# EAGLE design mimot (EAGLE 5.10)
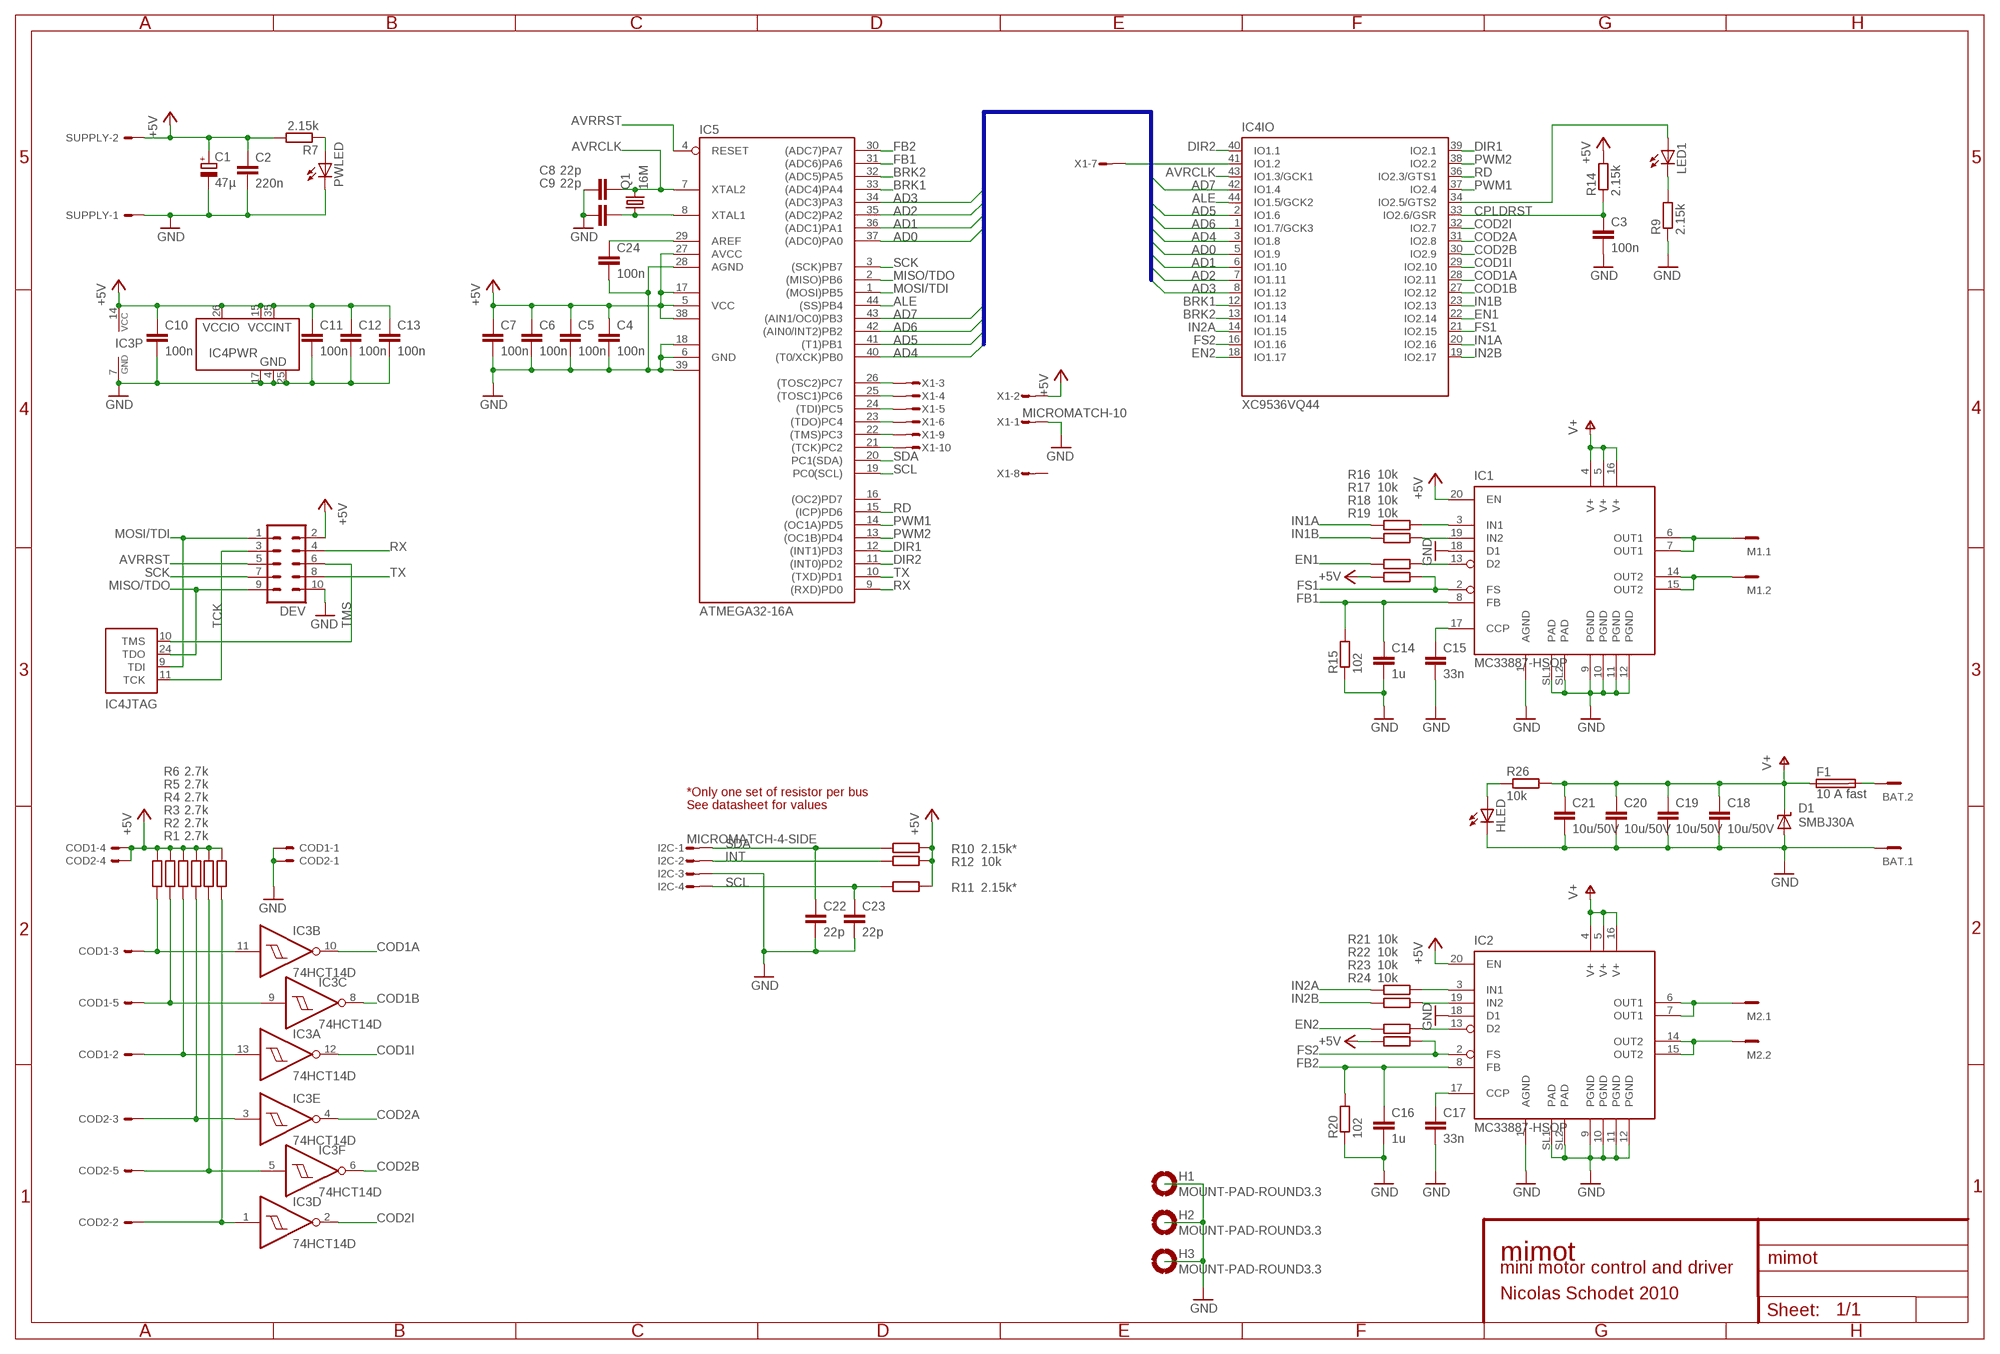
[diagram p0: schematic, sheet 1]

## Parts
BAT  MC2  [MC2]
C1  47µ  CPOL-EUC  [PANASONIC_C]
C2  220n  C-EUC0603  [C0603]
C3  100n  C-EUC0603  [C0603]
C4  100n  C-EUC0603  [C0603]
C5  100n  C-EUC0603  [C0603]
C6  100n  C-EUC0603  [C0603]
C7  100n  C-EUC0603  [C0603]
C8  22p  C-EUC0603  [C0603]
C9  22p  C-EUC0603  [C0603]
C10  100n  C-EUC0603  [C0603]
C11  100n  C-EUC0603  [C0603]
C12  100n  C-EUC0603  [C0603]
C13  100n  C-EUC0603  [C0603]
C14  1u  C-EUC0603  [C0603]
C15  33n  C-EUC0603  [C0603]
C16  1u  C-EUC0603  [C0603]
C17  33n  C-EUC0603  [C0603]
C18  10u/50V  C-EUC1210  [C1210]
C19  10u/50V  C-EUC1210  [C1210]
C20  10u/50V  C-EUC1210  [C1210]
C21  10u/50V  C-EUC1210  [C1210]
C22  22p  C-EUC0603  [C0603]
C23  22p  C-EUC0603  [C0603]
C24  100n  C-EUC0603  [C0603]
COD1  EC1X05  [EC1X05]
COD2  EC1X05  [EC1X05]
D1  SMBJ30A  SUPPRESSOR-SMBJ  [SMBJ]
DEV  ML10L  [ML10L]
F1  10 A fast  FUSE0448  [0448]
H1  MOUNT-PAD-ROUND3.3  [3,3-PAD]
H2  MOUNT-PAD-ROUND3.3  [3,3-PAD]
H3  MOUNT-PAD-ROUND3.3  [3,3-PAD]
HLED  LEDSMT1206  [1206]
I2C  MICROMATCH-4-SIDE  [MICROMATCH-4-SIDE]
IC1  MC33887-HSOP  [HSOP]
IC2  MC33887-HSOP  [HSOP]
IC3  74HCT14D  [SO14]
IC4  XC9536VQ44  [VQFP44]
IC5  ATMEGA32-16A  [TQFP44]
LED1  LEDSMT1206  [1206]
M1  MC2  [MC2]
M2  MC2  [MC2]
PWLED  LEDSMT1206  [1206]
Q1  16M  QUARTZ  [ABM3]
R1  2.7k  R-EU_R0603  [R0603]
R2  2.7k  R-EU_R0603  [R0603]
R3  2.7k  R-EU_R0603  [R0603]
R4  2.7k  R-EU_R0603  [R0603]
R5  2.7k  R-EU_R0603  [R0603]
R6  2.7k  R-EU_R0603  [R0603]
R7  2.15k  R-EU_R0603  [R0603]
R9  2.15k  R-EU_R0603  [R0603]
R10  2.15k*  R-EU_R0603  [R0603]
R11  2.15k*  R-EU_R0603  [R0603]
R12  10k  R-EU_R0603  [R0603]
R14  2.15k  R-EU_R0603  [R0603]
R15  102  R-EU_R0603  [R0603]
R16  10k  R-EU_R0603  [R0603]
R17  10k  R-EU_R0603  [R0603]
R18  10k  R-EU_R0603  [R0603]
R19  10k  R-EU_R0603  [R0603]
R20  102  R-EU_R0603  [R0603]
R21  10k  R-EU_R0603  [R0603]
R22  10k  R-EU_R0603  [R0603]
R23  10k  R-EU_R0603  [R0603]
R24  10k  R-EU_R0603  [R0603]
R26  10k  R-EU_R0603  [R0603]
SUPPLY  EC1X02  [EC1X02]
X1  MICROMATCH-10  [MICROMATCH-10]

## Nets
+5V [supply]: C1.+ C2.1 C4.1 C5.1 C6.1 C7.1 C10.1 C11.1 C12.1 C13.1 COD1.4 COD2.4 DEV.2 IC1.20(EN) IC2.20(EN) IC3.14(P:VCC) IC4.15(PWR:VCCINT) IC4.26(PWR:VCCIO) IC4.35(PWR:VCCINT) IC5.5(VCC) IC5.17(VCC1) IC5.27(AVCC) IC5.38(VCC2) R1.2 R2.2 R3.2 R4.2 R5.2 R6.2 R7.2 R10.2 R11.2 R12.2 R14.2 R19.1 R24.1 SUPPLY.2 X1.2
AD0: IC4.5(IO:IO1.9) IC5.37((ADC0)PA0)
AD1: IC4.6(IO:IO1.10) IC5.36((ADC1)PA1)
AD2: IC4.7(IO:IO1.11) IC5.35((ADC2)PA2)
AD3: IC4.8(IO:IO1.12) IC5.34((ADC3)PA3)
AD4: IC4.3(IO:IO1.8) IC5.40((T0/XCK)PB0)
AD5: IC4.2(IO:IO1.6) IC5.41((T1)PB1)
AD6: IC4.1(IO:IO1.7/GCK3) IC5.42((AIN0/INT2)PB2)
AD7: IC4.42(IO:IO1.4) IC5.43((AIN1/OC0)PB3)
ALE: IC4.44(IO:IO1.5/GCK2) IC5.44((SS)PB4)
AREF: C24.1 IC5.29(AREF)
AVRCLK: C8.2 IC4.43(IO:IO1.3/GCK1) IC5.7(XTAL2) Q1.2
AVRRST: DEV.5 IC5.4(RESET)
BRK1: IC4.12(IO:IO1.13) IC5.33((ADC4)PA4)
BRK2: IC4.13(IO:IO1.14) IC5.32((ADC5)PA5)
CCP1: C15.1 IC1.17(CCP)
CCP2: C17.1 IC2.17(CCP)
COD1A: IC3.10(B:O) IC4.28(IO:IO2.11)
COD1AP: COD1.3 IC3.11(B:I) R6.1
COD1B: IC3.8(C:O) IC4.27(IO:IO2.12)
COD1BP: COD1.5 IC3.9(C:I) R5.1
COD1I: IC3.12(A:O) IC4.29(IO:IO2.10)
COD1IP: COD1.2 IC3.13(A:I) R4.1
COD2A: IC3.4(E:O) IC4.31(IO:IO2.8)
COD2AP: COD2.3 IC3.3(E:I) R3.1
COD2B: IC3.6(F:O) IC4.30(IO:IO2.9)
COD2BP: COD2.5 IC3.5(F:I) R2.1
COD2I: IC3.2(D:O) IC4.32(IO:IO2.7)
COD2IP: COD2.2 IC3.1(D:I) R1.1
CPLDRST: C3.1 IC4.33(IO:IO2.6/GSR) R14.1
DIR1: IC4.39(IO:IO2.1) IC5.12((INT1)PD3)
DIR2: IC4.40(IO:IO1.1) IC5.11((INT0)PD2)
EN1: IC4.22(IO:IO2.14) R18.1
EN1M: IC1.13(D2) R18.2
EN2: IC4.18(IO:IO1.17) R23.1
EN2M: IC2.13(D2) R23.2
FB1: C14.1 IC1.8(FB) IC5.31((ADC6)PA6) R15.2
FB2: C16.1 IC2.8(FB) IC5.30((ADC7)PA7) R20.2
FS1: IC1.2(FS) IC4.21(IO:IO2.15) R19.2
FS2: IC2.2(FS) IC4.16(IO:IO1.16) R24.2
GND [supply]: BAT.1 C1.- C2.2 C3.2 C4.2 C5.2 C6.2 C7.2 C8.1 C9.1 C10.2 C11.2 C12.2 C13.2 C14.2 C15.2 C16.2 C17.2 C18.2 C19.2 C20.2 C21.2 C22.2 C23.2 C24.2 COD1.1 COD2.1 D1.A DEV.10 H1.B3,3(MOUNT) H2.B3,3(MOUNT) H3.B3,3(MOUNT) HLED.C I2C.3 IC1.1(AGND) IC1.9(PGND) IC1.10(PGND) IC1.11(PGND) IC1.12(PGND) IC1.18(D1) IC1.SL1(PAD) IC1.SL2(PAD) IC2.1(AGND) IC2.9(PGND) IC2.10(PGND) IC2.11(PGND) IC2.12(PGND) IC2.18(D1) IC2.SL1(PAD) IC2.SL2(PAD) IC3.7(P:GND) IC4.4(PWR:GND) IC4.17(PWR:GND) IC4.25(PWR:GND) IC5.6(GND) IC5.18(GND1) IC5.28(AGND) IC5.39(GND2) PWLED.C R9.1 R15.1 R20.1 SUPPLY.1 X1.1
IN1A: IC4.20(IO:IO2.16) R16.1
IN1AM: IC1.3(IN1) R16.2
IN1B: IC4.23(IO:IO2.13) R17.1
IN1BM: IC1.19(IN2) R17.2
IN2A: IC4.14(IO:IO1.15) R21.1
IN2AM: IC2.3(IN1) R21.2
IN2B: IC4.19(IO:IO2.17) R22.1
IN2BM: IC2.19(IN2) R22.2
INT: I2C.2 R12.1
MISO/TDO: DEV.9 IC4.24(JTAG:TDO) IC5.2((MISO)PB6)
MOSI/TDI: DEV.1 IC4.9(JTAG:TDI) IC5.1((MOSI)PB5)
NHLED: HLED.A R26.1
NLED1: LED1.C R9.2
NLED1X: IC4.34(IO:IO2.5/GTS2) LED1.A
NPWLED: PWLED.A R7.1
NV+: BAT.2 F1.P$2
OUT1A: IC1.6(OUT1) IC1.7(OUT1) M1.1
OUT1B: IC1.14(OUT2) IC1.15(OUT2) M1.2
OUT2A: IC2.6(OUT1) IC2.7(OUT1) M2.1
OUT2B: IC2.14(OUT2) IC2.15(OUT2) M2.2
PC2: IC5.21((TCK)PC2) X1.10
PC3: IC5.22((TMS)PC3) X1.9
PC4: IC5.23((TDO)PC4) X1.6
PC5: IC5.24((TDI)PC5) X1.5
PC6: IC5.25((TOSC1)PC6) X1.4
PC7: IC5.26((TOSC2)PC7) X1.3
PCX: IC4.41(IO:IO1.2) X1.7
PWM1: IC4.37(IO:IO2.4) IC5.14((OC1A)PD5)
PWM2: IC4.38(IO:IO2.2) IC5.13((OC1B)PD4)
RD: IC4.36(IO:IO2.3/GTS1) IC5.15((ICP)PD6)
RX: DEV.4 IC5.9((RXD)PD0)
SCK: DEV.7 IC5.3((SCK)PB7)
SCL: C23.1 I2C.4 IC5.19(PC0(SCL)) R11.1
SDA: C22.1 I2C.1 IC5.20(PC1(SDA)) R10.1
TCK: DEV.3 IC4.11(JTAG:TCK)
TMS: DEV.6 IC4.10(JTAG:TMS)
TX: DEV.8 IC5.10((TXD)PD1)
V+: C18.1 C19.1 C20.1 C21.1 D1.C F1.P$1 IC1.4(V+) IC1.5(V+) IC1.16(V+) IC2.4(V+) IC2.5(V+) IC2.16(V+) R26.2
XTAL1: C9.2 IC5.8(XTAL1) Q1.1
Unconnected: IC5.16((OC2)PD7) X1.8

## Buses
AD[0..7]

## Notes on the sheet
- *Only one set of resistor per bus
- See datasheet for values
- mimot
- mini motor control and driver
- Nicolas Schodet 2010

## Library data of the parts
BAT M1 M2 = con-phoenix-381_l:MC2: Mini-Combicon 3.81mm horizontal 2-polig MC 1,5/2-G-3,81 Artikel-Nr. 1803277
C1 = rcl:CPOL-EU: POLARIZED CAPACITOR, European symbol
C2-C24 = rcl:C-EU: CAPACITOR, European symbol
COD1 COD2 = apbteam_con-amp-he14:E?1X05: Male header simple row, 5 positions
D1 = diode:SUPPRESSOR-: Suppressor diode
DEV = con-harting-ml:ML10: HARTING
F1 = apbteam_fuse:FUSE: FUSE
H1-H3 = holes:MOUNT-PAD-ROUND: MOUNTING PAD, round
HLED LED1 PWLED = led:LED: LED OSRAM: - CHIPLED LG R971, LG N971, LY N971, LG Q971, LY Q971, LO R971, LY R971 LH N974, LH R974 LS Q976, LO Q976, LY Q976 LO Q996 - Hyper CHIPLED LW Q18S LB Q993, LB Q99A, LB R99A - SideLED LS A670, LO A670, LY A670, LG A670, LP A670 LB A673, LV A673, LT A673, LW A673 LH A674 LY A675 LS A676, LA A676, LO A676, LY A676, LW A676 LS A679, LY A679, LG A679 - Hyper Micro SIDELED® LS Y876, LA Y876, LO Y876, LY Y876 LT Y87S - SmartLED LW L88C, LW L88S LB L89C, LB L89S, LG L890 LS L89K, LO L89K, LY L89K LS L896, LA L896, LO L896, LY L896 - TOPLED LS T670, LO T670, LY T670, LG T670, LP T670 LSG T670, LSP T670, LSY T670, LOP T670, LYG T670 LG T671, LOG T671, LSG T671 LB T673, LV T673, LT T673, LW T673 LH T674 LS T676, LA T676, LO T676, LY T676, LB T676, LH T676, LSB T676, LW T676 LB T67C, LV T67C, LT T67C, LS T67K, LO T67K, LY T67K, LW E67C LS E67B, LA E67B, LO E67B, LY E67B, LB E67C, LV E67C, LT E67C LW T67C LS T679, LY T679, LG T679 LS T770, LO T770, LY T770, LG T770, LP T770 LB T773, LV T773, LT T773, LW T773 LH T774 LS E675, LA E675, LY E675, LS T675 LS T776, LA T776, LO T776, LY T776, LB T776 LHGB T686 LT T68C, LB T68C - Hyper Mini TOPLED® LB M676 - Mini TOPLED Santana® LG M470 LS M47K, LO M47K, LY M47K Source: http://www.osram.convergy.de - LUMILED® LXK2-PW12-R00, LXK2-PW12-S00, LXK2-PW14-U00, LXK2-PW14-V00 LXK2-PM12-R00, LXK2-PM12-S00, LXK2-PM14-U00 LXK2-PE12-Q00, LXK2-PE12-R00, LXK2-PE12-S00, LXK2-PE14-T00, LXK2-PE14-U00 LXK2-PB12-K00, LXK2-PB12-L00, LXK2-PB12-M00, LXK2-PB14-N00, LXK2-PB14-P00, LXK2-PB14-Q00 LXK2-PR12-L00, LXK2-PR12-M00, LXK2-PR14-Q00, LXK2-PR14-R00 LXK2-PD12-Q00, LXK2-PD12-R00, LXK2-PD12-S00 LXK2-PH12-R00, LXK2-PH12-S00 LXK2-PL12-P00, LXK2-PL12-Q00, LXK2-PL12-R00 Source: www.luxeon.com
I2C = apbteam_con-amp-micromatch:MICROMATCH-4: MicroMaTch 4
IC1 IC2 = apbteam_mc33887:MC33887-HSOP: 5.0 A H-Bridge with Load Current Feedback
IC3 = 74xx-eu:74*14: Hex schmitt trigger INVERTER
IC4 = apbteam_xilinx-cpld:XC9536*?44: XC9536 In-System Programmable CPLD 36 macrocells
IC5 = avr:ATMEGA32: MICROCONTROLLER 32 Kbytes FLASH 2 Kbytes SRAM 1 Kbytes EEPROM USART 8-channel 10 bit ADC
Q1 = ni-crystal:QUARTZ
R1-R7 R9-R12 R14-R24 R26 = rcl:R-EU_: RESISTOR, European symbol
SUPPLY = apbteam_con-amp-he14:E?1X02: Male header simple row, 2 positions
X1 = apbteam_con-amp-micromatch:MICROMATCH-10: MicroMaTch 10

## Net classes
1 supply: width 0.254 mm

## Board
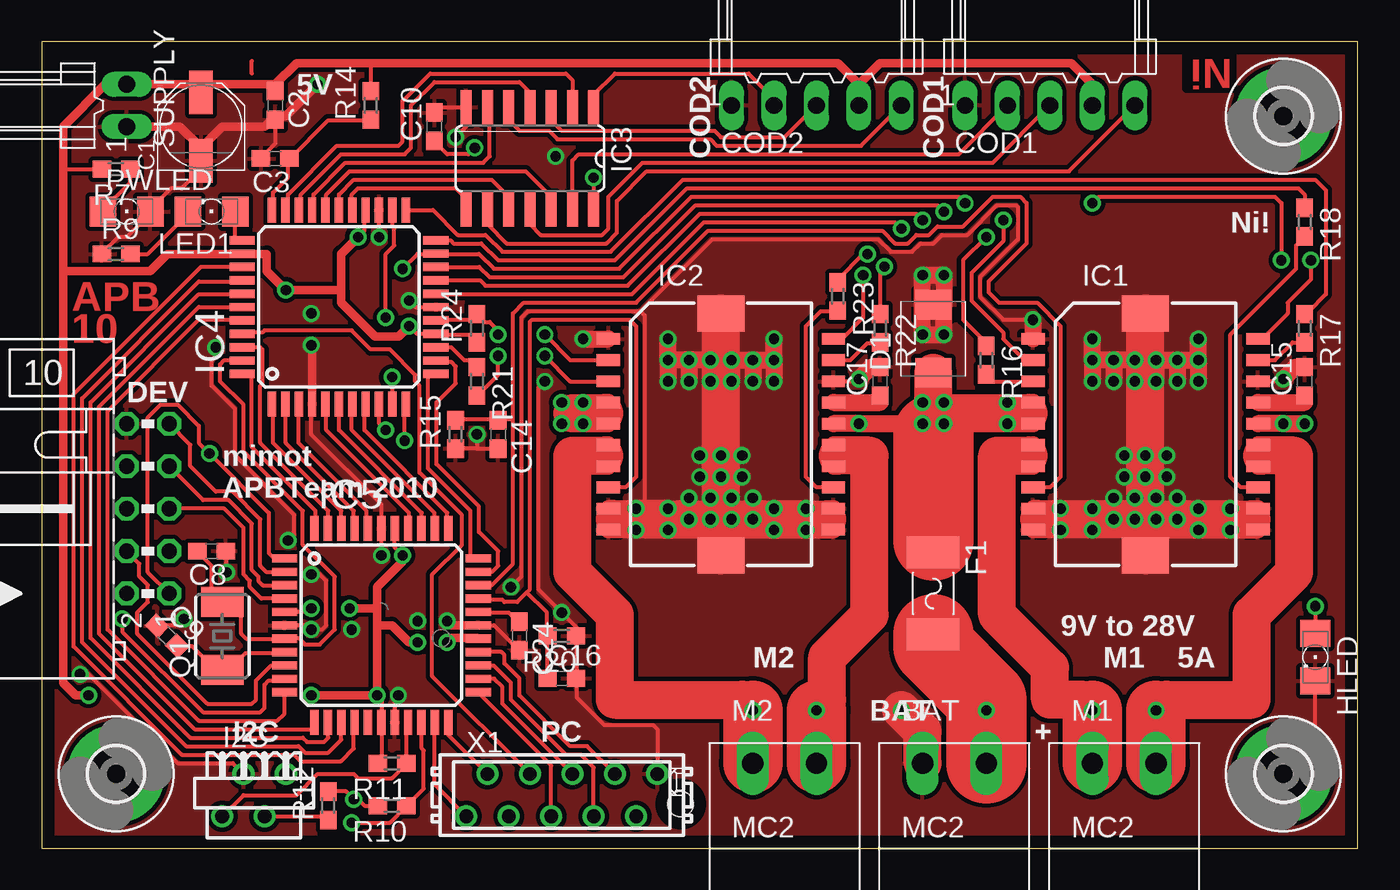
[diagram p1: board, top side]
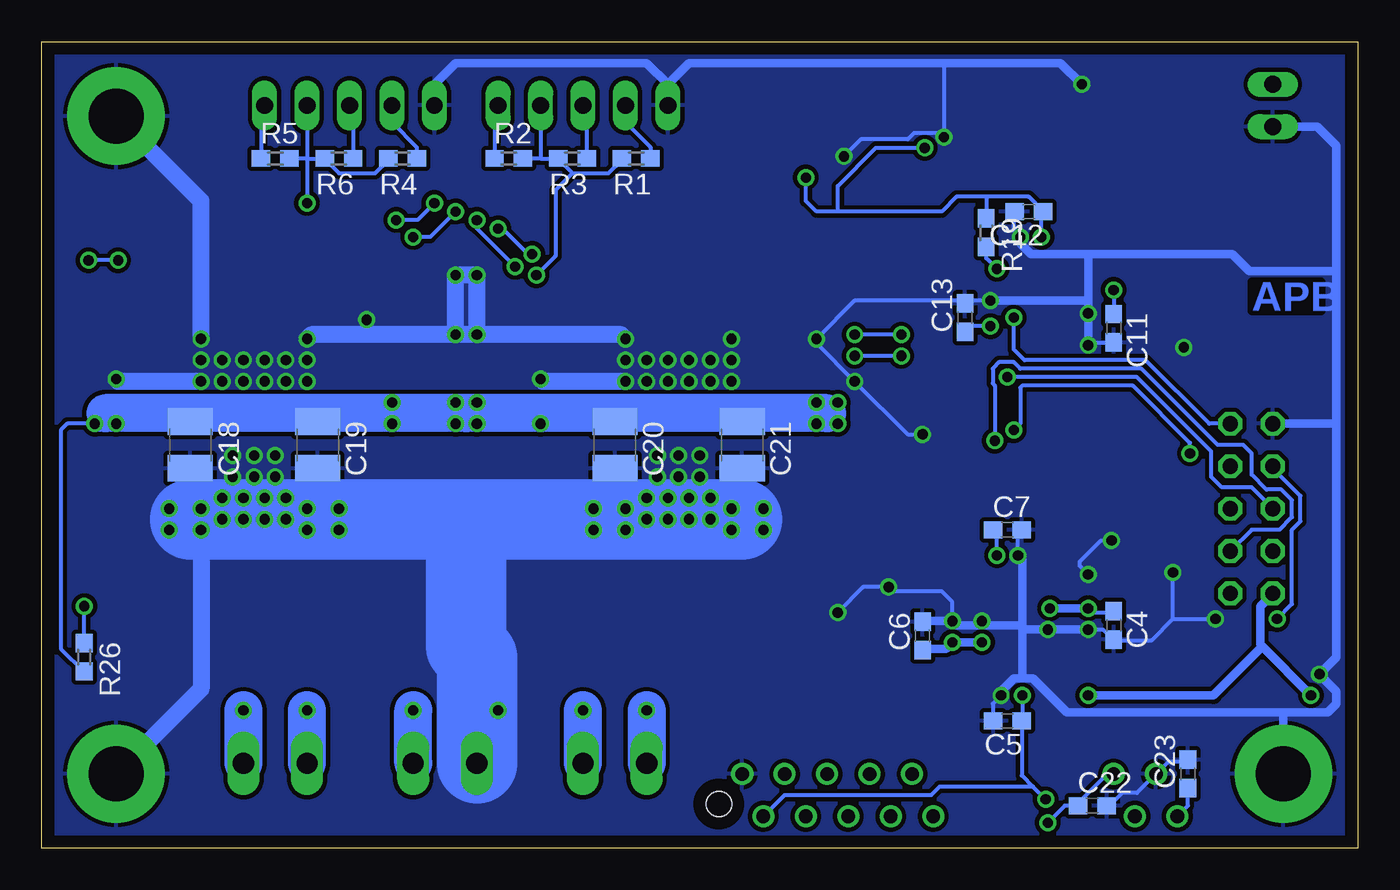
[diagram p2: board, bottom side, seen from below]

Size 78.74 x 48.26 mm. Coordinates in mm from the lower left corner, seen from the top.
Outline: 0,0 78.74,0 78.74,48.26 0,48.26 0,0
Copper layers (1*16): Top 0.035mm / dielectric 1.5mm / Bottom 0.035mm
Design rules "olimex *": minimum track width 10mil, minimum drill 24mil, track to track 10mil, track to pad 10mil, pad to pad 10mil, via to via 10mil, smd to smd 10mil, copper to edge 30mil, drill to drill 10mil, minimum pad ring 10mil, minimum via ring 8mil, stop-mask expansion 0mil, vias tented up to drill 100mil, thermal gap 10mil

### Footprints (pad centres in the part's own frame; a part is rotated, then mirrored left to right if it is on the bottom)
MC2 = drill 1.27 long: 1 -1.905,0; 2 1.905,0
PANASONIC_C = smd 2.6 x 1.4: + 2.05,0; - -2.05,0
C0603 = smd 1.1 x 1: 1 -0.85,0; 2 0.85,0
C1210 = smd 1.6 x 2.7: 1 -1.4,0; 2 1.4,0
EC1X05 = drill 1 long: 1 -5.08,0; 2 -2.54,0; 3 0,0; 4 2.54,0; 5 5.08,0
SMBJ = smd 1.78 x 2.16: A 2.04,0; C -2.03,0
ML10L = drill 0.914 octagon: 1 -5.08,-1.27; 2 -5.08,1.27; 3 -2.54,-1.27; 4 -2.54,1.27; 5 0,-1.27; 6 0,1.27; 7 2.54,-1.27; 8 2.54,1.27; 9 5.08,-1.27; 10 5.08,1.27
0448 = smd 1.9 x 3.15: P$1 -2.45,0; P$2 2.45,0
3,3-PAD = drill 3.3 pad 5.842 round: B3,3 0,0
1206 = smd 1.6 x 1.803: A -1.422,0; C 1.422,0
MICROMATCH-4-SIDE = drill 0.813 round: 1 1.905,1.27; 2 0.635,-1.27; 3 -0.635,1.27; 4 -1.905,-1.27
HSOP = smd 0.7 x 1.4: 1 -5.715,-6.731; 2 -4.445,-6.731; 3 -3.175,-6.731; 4 -1.905,-6.731; 5 -0.635,-6.731; 6 0.635,-6.731; 7 1.905,-6.731; 8 3.175,-6.731; 9 4.445,-6.731; 10 5.715,-6.731; 11 5.715,6.731; 12 4.445,6.731; 13 3.175,6.731; 14 1.905,6.731; 15 0.635,6.731; 16 -0.635,6.731; 17 -1.905,6.731; 18 -3.175,6.731; 19 -4.445,6.731; 20 -5.715,6.731 | smd 2.15 x 2.8: SL1 -7.239,0; SL2 7.239,0
SO14 = smd 0.66 x 2.032: 1 -3.81,-3.073; 2 -2.54,-3.073; 3 -1.27,-3.073; 4 0,-3.073; 5 1.27,-3.073; 6 2.54,-3.073; 7 3.81,-3.073; 8 3.81,3.073; 9 2.54,3.073; 10 1.27,3.073; 11 0,3.073; 12 -1.27,3.073; 13 -2.54,3.073; 14 -3.81,3.073
VQFP44 = smd 1.5 x 0.5: 1 -5.8,4; 2 -5.8,3.2; 3 -5.8,2.4; 4 -5.8,1.6; 5 -5.8,0.8; 6 -5.8,0; 7 -5.8,-0.8; 8 -5.8,-1.6; 9 -5.8,-2.4; 10 -5.8,-3.2; 11 -5.8,-4; 23 5.8,-4; 24 5.8,-3.2; 25 5.8,-2.4; 26 5.8,-1.6; 27 5.8,-0.8; 28 5.8,0; 29 5.8,0.8; 30 5.8,1.6; 31 5.8,2.4; 32 5.8,3.2; 33 5.8,4 | smd 0.5 x 1.5: 12 -4,-5.8; 13 -3.2,-5.8; 14 -2.4,-5.8; 15 -1.6,-5.8; 16 -0.8,-5.8; 17 0,-5.8; 18 0.8,-5.8; 19 1.6,-5.8; 20 2.4,-5.8; 21 3.2,-5.8; 22 4,-5.8; 34 4,5.8; 35 3.2,5.8; 36 2.4,5.8; 37 1.6,5.8; 38 0.8,5.8; 39 0,5.8; 40 -0.8,5.8; 41 -1.6,5.8; 42 -2.4,5.8; 43 -3.2,5.8; 44 -4,5.8
TQFP44 = smd 1.5 x 0.5: 1 -5.8,4; 2 -5.8,3.2; 3 -5.8,2.4; 4 -5.8,1.6; 5 -5.8,0.8; 6 -5.8,0; 7 -5.8,-0.8; 8 -5.8,-1.6; 9 -5.8,-2.4; 10 -5.8,-3.2; 11 -5.8,-4; 23 5.8,-4; 24 5.8,-3.2; 25 5.8,-2.4; 26 5.8,-1.6; 27 5.8,-0.8; 28 5.8,0; 29 5.8,0.8; 30 5.8,1.6; 31 5.8,2.4; 32 5.8,3.2; 33 5.8,4 | smd 0.5 x 1.5: 12 -4,-5.8; 13 -3.2,-5.8; 14 -2.4,-5.8; 15 -1.6,-5.8; 16 -0.8,-5.8; 17 0,-5.8; 18 0.8,-5.8; 19 1.6,-5.8; 20 2.4,-5.8; 21 3.2,-5.8; 22 4,-5.8; 34 4,5.8; 35 3.2,5.8; 36 2.4,5.8; 37 1.6,5.8; 38 0.8,5.8; 39 0,5.8; 40 -0.8,5.8; 41 -1.6,5.8; 42 -2.4,5.8; 43 -3.2,5.8; 44 -4,5.8
ABM3 = smd 1.778 x 2.54: 1 -2.032,0; 2 2.032,0
R0603 = smd 1.1 x 1: 1 -0.85,0; 2 0.85,0
EC1X02 = drill 1 long: 1 -1.27,0; 2 1.27,0
MICROMATCH-10 = drill 0.813 round: 1 5.715,1.27; 2 4.445,-1.27; 3 3.175,1.27; 4 1.905,-1.27; 5 0.635,1.27; 6 -0.635,-1.27; 7 -1.905,1.27; 8 -3.175,-1.27; 9 -4.445,1.27; 10 -5.715,-1.27 | hole 1.5: 7.11,-0.53

### Placement (x,y rotation side)
BAT  54.61,5.08 0 top
C1  9.53,43.18 90 top
C2  13.97,44.45 270 top
C3  13.97,41.27 180 top
C4  14.61,13.34 270 bottom
C5  20.95,7.62 180 bottom
C6  26.04,12.7 90 bottom
C7  20.95,19.05 0 bottom
C8  10.16,17.78 180 top
C9  7.49,12.7 315 top
C10  23.5,43.18 90 top
C11  14.61,31.11 270 bottom
C12  19.68,38.1 180 bottom
C13  23.5,31.75 90 bottom
C14  27.3,24.77 270 top
C15  75.56,27.94 90 top
C16  31.11,10.16 0 top
C17  50.16,27.94 90 top
C18  69.85,24.13 270 bottom
C19  62.23,24.13 270 bottom
C20  44.45,24.13 270 bottom
C21  36.83,24.13 270 bottom
C22  15.88,2.54 0 bottom
C23  10.16,4.45 90 bottom
C24  28.57,12.7 270 top
COD1  60.33,44.45 0 top
COD2  46.35,44.45 0 top
D1  53.34,30.48 90 top
DEV  6.35,20.32 90 top
F1  53.34,15.24 270 top
H1  4.45,4.45 0 top
H2  74.3,4.45 0 top
H3  74.3,43.81 0 top
HLED  76.2,11.43 270 top
I2C  12.7,3.17 0 top
IC1  66.04,24.77 270 top
IC2  40.64,24.77 270 top
IC3  29.21,41.27 180 top
IC4  17.78,32.38 90 top
IC5  20.32,13.34 0 top
LED1  10.16,38.1 180 top
M1  64.77,5.08 0 top
M2  44.45,5.08 0 top
PWLED  5.08,38.1 0 top
Q1  10.79,12.7 90 top
R1  43.18,41.27 180 bottom
R2  50.8,41.27 0 bottom
R3  46.99,41.27 180 bottom
R4  57.15,41.27 180 bottom
R5  64.77,41.27 0 bottom
R6  60.96,41.27 180 bottom
R7  4.45,40.64 180 top
R9  4.45,35.56 0 top
R10  20.95,2.54 180 top
R11  20.95,5.08 180 top
R12  17.14,2.54 90 top
R14  19.68,44.45 90 top
R15  24.77,24.77 90 top
R16  56.52,29.21 270 top
R17  75.56,31.11 270 top
R18  75.56,37.47 270 top
R19  22.23,36.83 270 bottom
R20  31.11,12.7 180 top
R21  26.04,27.94 270 top
R22  50.16,31.11 270 top
R23  47.62,33.02 270 top
R24  26.04,31.11 90 top
R26  76.2,11.43 270 bottom
SUPPLY  5.08,44.45 90 top
X1  31.11,3.17 0 top

### Tracks (layer width: path | path; a pad name or v marks a point on that pad's centre or on a via)
+5V  (via drill 0.61)
  Top 0.254: IC5.5 15.91,14.13 v16.13,14.35 | v33.02,40.13 IC3.14 | C10.1 23.5,42.29 24.26,41.53 25.53,41.53 v25.91,41.91 | IC5.38 21.12,18 v21.59,17.53 | IC4.26 19.3,38.1 19.3,36.96 v18.92,36.58 | v20.07,9.14 20.32,8.89 IC5.17 20.32,5.33 20.07,5.08 R11.2 | R10.2 19.3,2.54 18.92,2.92 v18.67,2.92 18.2,3.39 R12.2 | 1.27,40.64 R7.2 | v21.97,31.24 22.43,30.79 IC4.15 23.55,30.79 23.5,30.73 25.65,30.73 26.04,30.35 R24.1 | IC1.20 73.03,30.48 74.55,32 74.55,32.64 75.95,34.04 v75.95,35.18 | v74.17,35.18 74.17,38.61 73.79,38.99 63.25,38.99 v62.87,38.61 | IC2.20 47.88,30.48 49.15,31.75 v49.15,34.29 | 19.68,46.99 R14.2
  Top 0.508: 9.53,45.72 SUPPLY.2 3.81,45.72 1.27,43.18 1.27,40.64 1.27,34.54 | 9.53,45.72 C1.+ | 9.53,45.72 13.97,45.72 | 13.97,45.72 C2.1 | 13.97,45.72 15.24,46.99 19.68,46.99 47.62,46.99 48.9,45.72 | 48.9,45.72 COD2.4 | 48.9,45.72 50.16,46.99 61.59,46.99 62.87,45.72 COD1.4 | 1.27,34.54 1.27,9.91 2.03,9.14 v2.79,9.14 | 20.07,13.34 v20.07,9.14 v16.13,9.14 | 20.07,13.34 20.07,14.35 | 20.07,14.35 v18.41,14.35 | v21.59,17.53 21.59,17.14 20.07,15.62 20.07,14.35 | 20.07,13.34 20.95,13.34 21.97,12.32 v22.48,12.32 | IC5.27 26.07,12.54 26.04,12.57 24.51,12.57 v24.26,12.32 | 1.27,34.54 6.48,34.54 7.49,35.56 11.81,35.56 | v18.92,36.58 17.93,35.59 17.91,35.59 17.91,33.4 | v21.97,31.24 21.34,30.61 19.94,30.61 17.91,32.64 17.91,33.4 | IC4.35 11.84,35.59 11.81,35.56 | 11.81,35.56 13.46,35.56 13.46,34.54 v14.61,33.4 17.91,33.4
  Bottom 0.254: C4.1 14.73,14.1 15.88,14.1 v16.13,14.35 | C7.1 21.84,19.05 21.59,18.8 v21.59,17.53 | 62.87,41.27 R6.2 61.81,41.24 60.96,40.39 58.8,40.39 58,41.19 R4.2 | 62.87,41.27 R5.2 | COD1.4 62.87,41.27 | 48.9,41.27 R3.2 47.84,41.24 46.99,40.39 | 48.9,41.27 R2.2 | COD2.4 48.9,41.27 | R1.2 44.03,41.19 44.83,40.39 46.99,40.39 | v18.92,36.58 18.92,37.85 18.8,37.97 18.84,38.01 C12.1 18.84,38.14 19.68,38.99 22.23,38.99 | v20.07,9.14 20.07,7.75 20.11,7.71 C5.1 20.11,4.36 19.43,3.68 | 19.43,3.68 v18.67,2.92 | C13.1 23.5,31.24 v21.97,31.24 | v14.61,33.4 C11.1 | v33.02,40.13 33.02,38.73 32.38,38.1 31.11,38.1 | 31.11,38.1 24.89,38.1 24,38.99 22.23,38.99 | v74.17,35.18 v75.95,35.18 | 62.87,41.27 v62.87,38.61 | 22.23,38.99 R19.1 | 31.11,38.1 31.11,39.62 28.83,41.91 v25.91,41.91 | v49.15,34.29 48.01,35.43 48.01,39.37 46.99,40.39 | 19.43,3.68 25.02,3.68 25.53,3.17 34.29,3.17 X1.2
  Bottom 0.508: v18.41,14.35 v16.13,14.35 | v2.79,9.14 5.71,12.06 | 5.71,12.06 5.84,12.19 5.84,14.48 DEV.2 | 5.71,12.06 8.64,9.14 v16.13,9.14 | C6.1 26.04,11.94 24.64,11.94 v24.26,12.32 v22.48,12.32
AD0
  Top 0.254: IC5.37 21.97,19.18 21.97,20.07 17.02,25.02 17.02,26.42 16.98,26.45 IC4.5
AD1
  Top 0.254: IC5.36 22.72,19.16 22.73,19.18 22.73,20.07 17.78,25.02 IC4.6
AD2
  Top 0.254: IC5.35 23.52,19.28 23.5,19.3 23.5,20.07 18.54,25.02 18.54,26.54 18.58,26.5 IC4.7
AD3
  Top 0.254: IC5.34 24.32,19.24 24.26,19.3 24.26,20.07 19.3,25.02 19.3,26.42 19.38,26.49 IC4.8
AD4
  Top 0.254: IC5.40 19.43,19.3 19.43,20.19 15.37,24.26 15.37,26.42 15.38,26.43 IC4.3
AD5
  Top 0.254: IC5.41 18.72,19.25 18.67,19.3 18.67,20.19 14.61,24.26 14.61,26.67 14.58,26.64 IC4.2
AD6
  Top 0.254: IC5.42 17.92,19.16 | 17.92,19.16 17.91,19.18 | 17.92,19.16 17.92,20.18 13.84,24.26 13.84,26.42 13.78,26.48 IC4.1
AD7
  Top 0.254: IC5.43 17.12,19.15 17.14,19.18 17.14,20.19 13.08,24.26 13.08,27.69 13.21,27.81 13.21,29.84 13.08,29.97 12.06,29.97 12.05,29.98 IC4.42
ALE
  Top 0.254: IC5.44 16.34,19.14 16.38,19.18 16.38,20.19 12.57,24 12.57,28.19 12.38,28.39 IC4.44
AREF
  Top 0.254: IC5.29 26.16,14.1 27.94,14.1 28.49,13.55 C24.1
AVRCLK
  Top 0.254: IC4.43 11.96,29.18 11.94,29.21 10.92,29.21 10.67,28.96 10.67,27.94 12.06,26.54 12.06,23.75 15.62,20.19 15.62,18.16 17.53,16.26 17.53,13.08 16.64,12.19 15.75,12.19 15.37,12.57 14.61,12.57 14.57,12.54 IC5.7 12.23,12.54 11.94,12.83 11.94,13.97 11.18,14.73 Q1.2 10.67,14.73 10.54,14.86 10.16,14.86 10.16,16.89 9.4,17.65 9.4,17.78 C8.2
AVRRST
  Top 0.254: IC5.4 13.13,14.94 12.45,15.62 12.45,16 12.06,16.38 12.06,19.18 10.92,20.32 DEV.5
BRK1
  Top 0.254: IC5.33 25.72,17.34 25.65,17.4 25.65,20.19 23.11,22.73 23.11,28.45 23.18,28.39 IC4.12
BRK2
  Top 0.254: IC5.32 26.95,16.54 27.3,16.89 27.3,17.78 26.16,18.92 26.16,20.45 23.62,22.99 23.62,26.67 24.77,27.81 24.77,28.83 24.51,29.08 23.75,29.08 23.65,29.18 IC4.13
CCP1
  Top 1.016: C15.1 75.56,26.67 IC1.17
CCP2
  Top 1.016: C17.1 50.16,26.67 IC2.17
COD1A
  Top 0.254: IC3.10 27.94,38.99 26.92,40.01 18.67,40.01 17.78,39.12 IC4.28
COD1AP
  Top 0.254: COD1.3 56.9,41.02 35.94,41.02 33.91,38.99 33.91,37.08 33.53,36.7 29.84,36.7 29.21,37.34 IC3.11 29.21,38.23
  Bottom 0.254: R6.1 60.11,44.23 COD1.3
COD1B
  Top 0.254: IC3.8 25.4,38.86 24.77,39.5 18.92,39.5 18.54,39.12 18.54,38.23 IC4.27
COD1BP
  Top 0.254: COD1.5 61.47,40.51 36.2,40.51 34.42,38.73 34.42,36.83 33.78,36.2 27.81,36.2 26.67,37.34 IC3.9
  Bottom 0.254: R5.1 65.62,44.23 COD1.5
COD1I
  Top 0.254: IC3.12 30.48,38.99 28.96,40.51 18.41,40.51 17.02,39.12 17.02,38.35 16.98,38.32 IC4.29
COD1IP
  Top 0.254: COD1.2 54.86,41.53 32.13,41.53 31.75,41.15 IC3.13
  Bottom 0.254: R4.1 56.3,41.95 57.78,43.43 COD1.2
COD2A
  Top 0.254: IC3.4 29.21,45.21 28.57,45.85 23.5,45.85 22.1,44.45 22.1,41.91 21.72,41.53 17.91,41.53 15.49,39.12 15.49,38.23 15.45,38.19 IC4.31
COD2AP
  Top 0.254: COD2.3 44.45,42.55 40.64,42.55 40.26,42.93 31.11,42.93 30.48,43.56 IC3.3
  Bottom 0.254: R3.1 46.14,44.23 COD2.3
COD2B
  Top 0.254: IC3.6 26.67,44.32 26.8,44.2 26.8,41.4 26.42,41.02 18.16,41.02 16.26,39.12 16.26,38.35 16.13,38.23 IC4.30
COD2BP
  Top 0.254: COD2.5 49.02,42.04 40.39,42.04 40.01,42.42 30.86,42.42 30.35,42.93 28.57,42.93 27.94,43.56 IC3.5
  Bottom 0.254: R2.1 51.65,44.23 COD2.5
COD2I
  Top 0.254: IC3.2 31.75,45.97 31.37,46.35 23.24,46.35 21.59,44.7 21.59,42.29 21.34,42.04 17.65,42.04 14.73,39.12 14.73,38.35 14.58,38.2 IC4.32
COD2IP
  Top 0.254: COD2.2 43.81,44.83 42.29,46.35 34.29,46.35 33.02,45.09 IC3.1 33.02,44.32
  Bottom 0.254: R1.1 42.33,41.95 43.81,43.43 COD2.2
CPLDRST
  Top 0.254: 13.72,38.1 13.78,38.16 IC4.33 13.78,38.29 13.84,38.35 13.84,39.24 14.73,40.13 14.73,41.15 14.82,41.24 C3.1 14.86,41.27 17.14,43.56 19.56,43.56 19.6,43.6 R14.1
DIR1
  Top 0.254: IC4.39 9.4,32.38 3.43,26.42 3.43,12.83 9.14,7.11 16.26,7.11 16.32,7.18 IC5.12
DIR2
  Top 0.254: IC4.40 11.94,31.62 9.4,31.62 3.94,26.16 3.94,13.08 9.4,7.62 14.1,7.62 14.52,8.04 IC5.11
EN1
  Top 0.254: IC4.22 24.45,36.38 24.64,36.2 26.29,36.2 27.3,35.18 34.29,35.18 38.61,39.5 75.18,39.5 75.56,39.12 R18.1
EN1M
  Top 0.254: IC1.13 71.75,21.59 71.12,22.23 71.12,30.73 75.06,34.67 75.06,36.07 75.56,36.58 R18.2
EN2  (via drill 0.61)
  Top 0.254: IC4.18 23.62,33.15 35.31,33.15 39.62,37.47 51.05,37.47 v51.44,37.08 | R23.1 47.62,34.04 49.15,35.56 v49.4,35.56
  Bottom 0.254: v51.44,37.08 51.18,37.08 49.66,35.56 v49.4,35.56
EN2M
  Top 0.254: IC2.13 46.35,21.59 45.72,22.23 45.72,31.24 46.61,32.13 47.62,32.13 R23.2
FB1
  Top 0.254: IC1.8 60.33,21.59 60.96,22.23 60.96,31.24 59.56,32.64 57.28,32.64 56.64,33.27 56.64,33.91 58.93,36.2 58.93,38.61 58.55,38.99 56.9,38.99 55.12,37.21 53.59,37.21 53.09,36.7 52.32,36.7 51.82,36.2 51.05,36.2 50.29,36.96 39.88,36.96 35.56,32.64 28.83,32.64 28.19,32 28.19,25.65 | IC5.31 26.91,15.73 28.19,17.02 28.19,25.65 | 28.19,25.65 27.3,25.65 | 27.3,25.65 C14.1 | R15.2 24.77,25.65 27.3,25.65
FB2
  Top 0.254: IC2.8 34.92,21.59 35.56,22.23 35.56,31.24 35.18,31.62 29.34,31.62 29.21,31.5 29.21,15.49 29.02,15.3 | 29.02,15.3 28.45,14.73 27.69,14.73 27.56,14.86 26.29,14.86 26.21,14.94 IC5.30 | 30.23,12.7 R20.2 | 30.23,12.7 30.23,10.29 30.27,10.25 C16.1 30.27,12.66 30.23,12.7 | 30.23,12.7 30.23,14.1 29.02,15.3
FS1  (via drill 0.61)
  Top 0.254: v21.59,34.67 22.48,35.56 23.5,35.56 23.52,35.59 IC4.21 23.6,35.59 23.62,35.56 26.16,35.56 27.05,34.67 34.54,34.67 38.86,38.99 54.86,38.99 v55.24,38.61 | IC1.2 58.8,29.21 57.53,30.48 57.53,30.86 55.63,32.77 55.63,34.42 57.53,36.32 v57.53,37.59
  Bottom 0.254: R19.2 22.23,35.31 v21.59,34.67 | v55.24,38.61 56.26,37.59 v57.53,37.59
FS2  (via drill 0.61)
  Top 0.254: IC4.16 23.62,31.62 25.65,31.62 26,31.96 R24.2 26.04,31.88 26.42,31.5 26.8,31.5 27.3,30.99 v27.3,30.73 | IC2.2 31.62,29.21 v30.1,30.73
  Bottom 0.254: v27.3,30.73 v30.1,30.73
GND  (via drill 0.61)
  Top 0.254: 25.4,44.32 IC3.7 | C10.2 23.5,44.07 23.75,44.32 25.4,44.32 | 25.4,44.32 25.4,43.18 v24.77,42.55 | IC4.4 16.18,26.21 16.13,26.16 16.13,24.77 20.32,20.57 IC5.39 v20.32,17.53 | IC4.25 20.18,38.11 20.19,38.1 v20.19,36.58 | v10.41,29.97 10.41,29.46 10.16,29.21 10.16,27.69 11.56,26.29 11.56,23.5 15.11,19.94 15.11,18.8 v14.73,18.41 | v16.13,16.38 16.64,16.38 17.02,16 17.02,13.34 16.76,13.08 v16.13,13.08 15.88,13.34 IC5.6 | IC5.18 21.12,8.93 v21.34,9.14 | C8.1 11.05,17.78 v11.05,16.51 | v2.29,10.41 2.79,10.41 8.13,5.08 11.43,5.08 I2C.3 | C9.1 6.95,13.3 6.99,13.34 8.13,13.34 v8.51,13.72 | C24.2 28.57,11.81 27.05,13.34 IC5.28 | 9.53,41.15 9.53,40.51 9.4,40.51 8.38,39.5 7.75,39.5 6.5,38.25 PWLED.C 6.5,38 5.08,36.58 4.57,36.58 3.6,35.6 R9.1 | v28.07,15.62 28.7,16.26 28.7,31.75 29.08,32.13 35.81,32.13 | 35.81,32.13 36.07,31.88 36.07,19.68 | IC4.17 22.35,32.38 v21.97,32.77 | C14.2 27.3,23.88 27.27,23.91 26.04,23.91 | 26.04,23.91 R15.1 | 26.04,23.91 v26.04,24.76 v26.04,24.77 | v30.1,27.94 29.72,27.56 29.72,15.49 v31.11,14.1 32,13.21 32,12.83 31.96,12.79 R20.1 32,12.7 32,10.16 C16.2 31.96,10.07 32,10.03 32,9.02 33.66,7.37 36.58,7.37 36.83,7.11 X1.1 | 35.81,32.13 40.13,36.45 50.04,36.45 50.8,35.69 52.07,35.69 52.58,36.2 53.34,36.2 53.85,36.7 55.37,36.7 57.15,38.48 58.29,38.48 58.42,38.35 58.42,36.45 56.13,34.16 56.13,33.02 57.53,31.62 v59.31,31.62 | HLED.C 76.2,6.35 H2.B3,3 | C3.2 13.08,41.27 13.97,42.16 C2.2 | v48.9,28.07 48.77,27.94 IC2.18 | v74.3,28.07 74.17,27.94 IC1.18
  Top 0.508: SUPPLY.1 8.26,43.18 9.53,41.91 | 9.53,41.91 9.53,41.15 C1.- | 9.53,41.91 10.79,43.18 13.34,43.18 13.97,43.81 | 13.97,43.81 C2.2 | 13.97,43.81 14.61,43.81 v16.51,45.72 | v24.26,13.59 24.51,13.34 IC5.28 | IC4.4 16.18,30.05 v16.13,30.1
  Top 1.016: IC1.12 72.39,20.32 72.39,19.68 72.39,19.05 IC1.11 | IC1.9 59.69,20.32 59.69,19.68 59.69,19.05 IC1.10 | IC2.12 46.99,20.32 46.99,19.68 46.99,19.05 IC2.11 | IC2.9 34.29,20.32 34.29,19.68 34.29,19.05 IC2.10 | 53.98,32.38 53.98,32.51 53.97,32.52 D1.A 52.71,32.52 52.7,32.51 52.7,32.38 | 53.98,32.38 v53.98,30.73 v52.7,30.73 52.7,32.38 | 53.98,32.38 v53.98,34.29 v52.7,34.29 52.7,32.38 | v32.38,30.48 IC2.1 | v59.31,31.62 IC1.1 | v66.67,29.21 66.04,28.57 v65.41,29.21 | v66.67,29.21 v67.94,29.21 | v67.94,29.21 v69.22,29.21 | v69.22,29.21 v69.22,30.48 | v69.22,29.21 v69.22,27.94 | v67.94,29.21 v67.94,27.94 | v66.67,29.21 v66.67,27.94 | v65.41,29.21 v65.41,27.94 | v65.41,29.21 v64.14,29.21 | v64.14,29.21 v64.14,27.94 | v64.14,29.21 v62.87,29.21 | v62.87,29.21 v62.87,30.48 | v62.87,29.21 v62.87,27.94 | v41.27,29.21 40.64,28.57 v40.01,29.21 | v41.27,29.21 v42.55,29.21 | v42.55,29.21 v43.81,29.21 | v43.81,29.21 v43.81,30.48 | v43.81,29.21 v43.81,27.94 | v42.55,29.21 v42.55,27.94 | v38.73,29.21 v38.73,27.94 | v40.01,29.21 v38.73,29.21 | v38.73,29.21 v37.47,29.21 | v37.47,29.21 v37.47,27.94 | v37.47,29.21 v37.47,30.48 | v41.27,29.21 v41.27,27.94 | v40.01,29.21 v40.01,27.94 | 40.64,20.32 v41.27,20.95 | 40.64,20.32 v41.27,19.68 v42.55,19.68 v42.55,20.95 | 40.64,20.32 v40.01,20.95 | 40.64,20.32 v40.01,19.68 v38.73,19.68 v38.73,20.95 | v41.91,22.23 v40.64,22.23 v39.37,22.23 | v39.37,23.5 v40.64,23.5 v41.91,23.5 | 66.04,20.32 v66.67,20.95 | 66.04,20.32 v65.41,20.95 | 66.04,20.32 v66.67,19.68 v67.94,19.68 v67.94,20.95 | 66.04,20.32 v65.41,19.68 v64.14,19.68 v64.14,20.95 | v69.22,19.05 68.58,19.68 v69.22,20.32 v71.12,20.32 | v62.87,20.32 63.5,19.68 v62.87,19.05 v60.96,19.05
  Top 1.016: v67.31,22.23 v66.04,22.23 v64.77,22.23 | v67.31,23.5 v66.04,23.5 v64.77,23.5 | C17.2 49.62,28.79 v48.9,28.07 | C15.2 75.02,28.79 v74.3,28.07 | v45.72,20.32 v43.81,20.32 43.18,19.68 v43.81,19.05 v45.72,19.05 | v35.56,20.32 v37.47,20.32 38.1,19.68 v37.47,19.05 v35.56,19.05
  Top 2.286: 59.69,19.68 63.5,19.68 v64.14,19.68 v65.41,19.68 66.04,19.68 | 66.04,19.68 v66.67,19.68 v67.94,19.68 68.58,19.68 72.39,19.68 | 66.04,19.68 IC1.SL2 | 66.04,19.68 66.04,20.32 v66.04,22.23 v66.04,23.5 66.04,28.57 IC1.SL1 | 40.64,19.68 IC2.SL2 | 34.29,19.68 36.07,19.68 38.1,19.68 v38.73,19.68 v40.01,19.68 40.64,19.68 | 40.64,19.68 v41.27,19.68 v42.55,19.68 43.18,19.68 46.99,19.68 | 40.64,19.68 40.64,20.32 v40.64,22.23 v40.64,23.5 40.64,28.57 IC2.SL1 | BAT.1 52.7,6.99 v51.44,8.26
  Bottom 0.254: v16.13,13.08 15.24,13.08 14.64,12.48 C4.2 14.61,12.45 12.32,12.45 11.05,13.72 | C7.2 20.07,19.05 20.32,18.8 v20.32,17.53 | C12.2 20.54,38.01 20.57,37.97 20.57,36.96 v20.19,36.58 | v16.13,16.38 16.64,16.89 16.64,17.14 15.37,18.41 v14.73,18.41 | C23.2 10.16,5.21 11.3,5.21 I2C.3 13.21,3.3 14.1,3.3 14.86,2.54 C22.2 | v21.34,9.14 21.84,8.64 21.84,7.62 C5.2 | v24.26,13.59 24.26,14.73 24.89,15.37 27.81,15.37 v28.07,15.62 29.59,15.62 v31.11,14.1 | v21.97,32.77 23.5,32.77 | C11.2 15.96,30.27 v16.13,30.1 | 24.77,46.99 v24.77,42.55 25.02,42.8 26.54,42.8 26.92,42.42 29.72,42.42 v30.73,41.4 | 23.5,32.77 C13.2 | 23.5,32.77 30.1,32.77 v32.38,30.48 32.38,30.23 v30.1,27.94 26.92,24.77 v26.04,24.77 | 11.05,13.72 v8.51,13.72 | 11.05,13.72 v11.05,16.51
  Bottom 0.508: 41.27,45.72 COD2.1 | 41.27,45.72 42.55,46.99 53.98,46.99 55.24,45.72 COD1.1 | v16.51,45.72 17.78,46.99 24.77,46.99 40.01,46.99 41.27,45.72 | SUPPLY.1 2.41,43.18 1.27,42.04 1.27,34.54 | 1.27,25.4 1.27,34.54 | 1.27,25.4 DEV.10 | 1.27,25.4 1.27,11.43 v2.29,10.41 1.27,9.4 1.27,8.64 1.78,8.13 4.45,8.13 | 20.07,10.16 20.07,13.08 | 20.07,13.08 v18.54,13.08 v16.13,13.08 | 20.07,13.08 20.07,13.34 | 20.07,13.34 20.07,17.27 v20.32,17.53 | 20.07,10.16 19.43,10.16 17.4,8.13 4.45,8.13 | v21.34,9.14 21.34,9.4 20.57,10.16 20.07,10.16 | H1.B3,3 4.45,8.13 | 20.07,13.34 22.48,13.34 | 22.48,13.34 24,13.34 v24.26,13.59 26.04,13.59 C6.2 | 1.27,34.54 6.48,34.54 7.49,35.56 16.13,35.56 | v20.19,36.58 20.19,36.2 19.56,35.56 16.13,35.56 | 16.13,35.56 16.13,32.77 | 16.13,32.77 v16.13,32 v16.13,30.1 | 16.13,32.77 v21.97,32.77 | 22.48,13.34 v22.48,13.59
  Bottom 1.016: v42.55,19.68 v42.55,20.95 | v37.47,20.32 36.83,20.95 C21.2 36.83,22.86 | v43.81,20.32 44.45,20.95 C20.2 | v69.22,20.32 69.85,20.95 C18.2 69.85,22.86 | C19.2 62.23,20.95 v62.87,20.32 v60.96,20.32 | v69.22,30.48 69.22,38.73 H3.B3,3 | H2.B3,3 69.22,9.53 v69.22,19.05 v71.12,19.05 | v52.7,30.73 44.07,30.73 v43.81,30.48 | v43.81,27.94 48.77,27.94 v48.9,28.07 | v69.22,27.94 74.17,27.94 v74.3,28.07 | v53.98,30.73 62.61,30.73 v62.87,30.48 | v52.7,30.73 v53.98,30.73 | v53.98,30.73 v53.98,34.29 v52.7,34.29 v52.7,30.73
  Bottom 2.286: 52.7,8.26 v51.44,8.26
  Bottom 4.826: BAT.1 52.7,8.26 52.7,11.43 53.34,12.06 53.34,19.68 | 53.34,19.68 v42.55,19.68 36.83,19.68 | 53.34,19.68 v65.41,19.68 69.85,19.68
  pour Bottom (isolate 0.254): 0,48.26 78.74,48.26 78.74,0 0,0
  pour Top (isolate 0.254): 0,48.26 78.74,48.26 78.74,0 0,0
IN1A  (via drill 0.61)
  Top 0.254: IC4.20 26.18,34.78 26.8,34.16 34.8,34.16 39.12,38.48 53.59,38.48 v53.98,38.1 | R16.1 56.52,30.23 55.12,31.62 55.12,35.18 v56.52,36.58
  Bottom 0.254: v53.98,38.1 55.5,36.58 v56.52,36.58
IN1AM
  Top 0.254: R16.2 56.52,28.32 56.9,27.94 IC1.3
IN1B
  Top 0.254: IC4.23 23.41,38.19 24.89,36.7 26.54,36.7 27.56,35.69 34.04,35.69 38.35,40.01 76.2,40.01 76.83,39.37 76.83,33.15 75.78,32.09 R17.1
IN1BM
  Top 0.254: R17.2 74.84,30.27 73.79,29.21 IC1.19
IN2A
  Top 0.254: IC4.14 24.5,29.98 25.27,29.21 26.04,29.21 R21.1
IN2AM  (via drill 0.61)
  Top 0.254: IC2.3 31.62,27.94 v30.1,29.46 | R21.2 26.04,27.05 27.3,28.32 v27.3,29.46
  Bottom 0.254: v27.3,29.46 v30.1,29.46
IN2B  (via drill 0.61)
  Top 0.254: IC4.19 26.21,33.98 26.54,33.66 35.05,33.66 39.37,37.97 52.32,37.97 v52.7,37.59 | v50.42,34.8 50.16,34.54 R22.1
  Bottom 0.254: v52.7,37.59 52.7,37.08 v50.42,34.8
IN2BM
  Top 0.254: IC2.19 48.39,29.21 49.4,30.23 50.16,30.23 R22.2
INT
  Top 0.254: R12.1 17.14,1.78 17.02,1.91 I2C.2
MISO/TDO  (via drill 0.61)
  Top 0.254: IC5.2 14.48,16.51 13.46,16.51 13.08,16.89 13.08,19.68 11.43,21.34 10.41,21.34 8.89,22.86 8.89,24.13 DEV.9 | IC4.24 20.98,37.19 21.08,37.08 21.08,36.07 20.57,35.56 v20.57,31.75
  Bottom 0.254: v20.57,31.75 20.57,29.84 19.94,29.21 12.7,29.21 8.89,25.4 DEV.9
MOSI/TDI  (via drill 0.61)
  Top 0.254: IC4.9 20.18,26.56 20.19,26.54 20.19,25.4 v20.57,25.02 | IC5.1 14.52,17.36 14.48,17.4 13.84,17.4 13.59,17.65 13.59,20.07 v10.03,23.62 9.4,24.26 9.4,25.27 8.13,26.54 7.11,26.54 6.35,25.78 6.35,16.51 DEV.1
  Bottom 0.254: v20.57,25.02 20.19,25.4 20.19,27.56 20.07,27.69 13.46,27.69 10.03,24.26 v10.03,23.62
N$1
  Top 0.254: 12.57,46.35 12.57,47.12
NHLED  (via drill 0.61)
  Top 0.254: v76.2,14.48 HLED.A
  Bottom 0.254: 76.2,12.19 R26.1 v76.2,14.48
NLED1
  Top 0.254: LED1.C 8.74,37.95 6.35,35.56 R9.2
NLED1X
  Top 0.254: IC4.34 11.62,36.38 11.56,36.45 11.56,38.1 LED1.A
NPWLED
  Top 0.254: PWLED.A 3.66,38.2 5.29,39.84 R7.1
NV+  (via drill 0.61)
  Top 4.826: BAT.2 v56.52,8.26 56.52,8.89 53.34,12.06 F1.P$2
  Bottom 2.286: BAT.2 v56.52,8.26
OUT1A  (via drill 0.61)
  Top 1.016: IC1.6 59.05,24.13 59.05,23.5 59.05,22.86 IC1.7
  Top 2.286: 59.05,23.5 57.15,23.5 57.15,13.97 60.33,10.79 60.33,8.89 62.23,8.89 v62.87,8.26
  Top 3.556: M1.1 v62.87,8.26
  Bottom 2.286: M1.1 v62.87,8.26
OUT1B  (via drill 0.61)
  Top 1.016: IC1.15 73.03,24.13 73.03,23.5 73.03,22.86 IC1.14
  Top 2.286: 73.03,23.5 74.93,23.5 74.93,16.51 72.39,13.97 72.39,8.89 67.31,8.89 v66.67,8.26
  Top 3.556: M1.2 v66.67,8.26
  Bottom 2.286: M1.2 v66.67,8.26
OUT2A  (via drill 0.61)
  Top 1.016: IC2.6 33.66,24.13 33.66,23.5 33.66,22.86 IC2.7
  Top 2.286: 33.66,23.5 31.75,23.5 31.75,16.51 34.29,13.97 34.29,8.89 41.91,8.89 v42.55,8.26
  Top 3.556: v42.55,8.26 M2.1
  Bottom 2.286: v42.55,8.26 M2.1
OUT2B  (via drill 0.61)
  Top 1.016: IC2.15 47.62,24.13 47.62,23.5 47.62,22.86 IC2.14
  Top 2.286: v46.35,8.26 46.99,8.89 46.99,11.43 49.53,13.97 49.53,23.5 47.62,23.5
  Top 3.556: M2.2 v46.35,8.26
  Bottom 2.286: M2.2 v46.35,8.26
PC2
  Top 0.254: IC5.21 23.5,7.54 23.5,3.81 X1.10
PC3
  Top 0.254: IC5.22 24.32,6.79 X1.9
PC4
  Top 0.254: IC5.23 26.12,9.31 30.48,4.95 X1.6
PC5
  Top 0.254: 26.14,10.13 IC5.24 | 26.14,10.13 26.16,10.16 | 26.14,10.13 27.08,10.13 27.56,9.65 27.56,8.64 X1.5
PC6
  Top 0.254: IC5.25 26.15,10.94 26.16,10.92 27.05,10.92 28.07,9.91 28.07,8.89 31.37,5.59 32.26,5.59 33.02,4.83 X1.4
PC7
  Top 0.254: IC5.26 27.51,11.73 27.69,11.56 27.69,11.05 28.57,10.16 28.57,9.14 31.62,6.1 32.64,6.1 X1.3
PCX
  Top 0.254: IC4.41 12.06,30.86 13.21,30.86 13.34,30.99 18.54,30.99 19.68,29.84 20.83,29.84 22.35,28.32 22.35,27.94 22.61,27.69 22.61,22.48 25.15,19.94 25.15,18.16 23.37,16.38 23.37,10.29 X1.7
PWM1
  Top 0.254: IC4.37 11.89,33.98 11.81,33.91 9.4,33.91 2.41,26.92 2.41,12.32 8.64,6.1 15.37,6.1 15.75,5.71 17.14,5.71 17.92,6.49 IC5.14
PWM2
  Top 0.254: IC4.38 11.85,33.19 11.81,33.15 9.4,33.15 2.92,26.67 2.92,12.57 8.89,6.6 15.62,6.6 15.88,6.35 16.89,6.35 17.14,6.6 17.14,7.49 17.12,7.52 IC5.13
RD
  Top 0.254: IC4.36 11.82,34.78 11.81,34.8 9.53,34.8 1.91,27.18 1.91,12.06 8.38,5.59 15.11,5.59 15.49,5.21 17.91,5.21 18.67,5.97 18.67,7.49 IC5.15
RX
  Top 0.254: IC5.9 13.73,10.94 12.83,10.03 12.83,8.89 12.57,8.64 9.91,8.64 5.71,12.83 5.71,14.1 6.35,14.73 6.35,15.75 5.84,16.26 5.84,17.02 DEV.4
SCK
  Top 0.254: IC5.3 13.22,15.73 12.95,16 12.95,16.26 12.57,16.64 12.57,19.43 11.18,20.83 9.65,20.83 DEV.7
SCL
  Top 0.254: IC5.19 21.89,7.54 21.84,7.49 21.84,5.21 21.72,5.08 R11.1 21.8,5.04 20.95,4.19 18.92,4.19 18.67,4.45 16.51,4.45 15.24,3.17 12.06,3.17 I2C.4
  Bottom 0.254: C23.1 10.16,2.54 I2C.4
SDA  (via drill 0.61)
  Top 0.254: IC5.20 22.72,7.51 22.73,7.49 22.73,5.97 22.86,5.84 22.86,3.56 21.84,2.54 R10.1 21.8,2.5 20.83,1.52 v18.54,1.52
  Bottom 0.254: v18.54,1.52 17.53,2.54 C22.1 16.73,2.71 14.99,4.45 I2C.1
TCK  (via drill 0.61)
  Top 0.254: IC4.11 21.76,26.59 21.72,26.54 v21.72,24.38
  Bottom 0.254: v21.72,24.38 21.72,27.69 21.84,27.81 21.84,28.7 21.46,29.08 20.57,29.08 20.19,28.7 12.95,28.7 8.38,24.13 6.86,24.13 6.35,23.62 6.35,22.35 5.46,21.46 4.57,21.46 3.94,20.83 3.94,19.81 4.7,19.05 6.35,19.05 DEV.3
TMS  (via drill 0.61)
  Top 0.254: IC4.10 20.98,26.64 20.95,26.67 v20.95,28.19
  Bottom 0.254: v20.95,28.19 13.21,28.19 8.76,23.75 8.76,22.23 8.13,21.59 6.35,21.59 DEV.6
TX  (via drill 0.61)
  Top 0.254: IC5.10 14.35,10.03 13.59,10.03 13.34,9.78 13.34,8.38 13.08,8.13 9.65,8.13 4.83,12.95 v4.83,13.72
  Bottom 0.254: v4.83,13.72 3.94,14.61 3.94,19.05 3.43,19.56 3.43,21.08 5.08,22.73 DEV.8
V+  (via drill 0.61)
  Top 1.016: 53.34,24.77 53.34,25.4 v48.9,25.4 IC2.16 | IC1.16 v74.3,25.4 v75.56,25.4 | IC2.4 33.66,26.67 33.66,26.04 33.66,25.4 IC2.5 | IC1.4 59.05,26.67 59.05,26.04 59.05,25.4 IC1.5 | v52.7,26.67 53.34,26.04 | v53.98,26.67 53.34,26.04 | v53.98,25.4 53.34,26.04 | v52.7,25.4 53.34,26.04 | 31.75,26.04 v31.11,26.67 | 31.75,26.04 v31.11,25.4 | 31.75,26.04 v32.38,26.67 | v32.38,25.4 31.75,26.04 | v57.78,26.67 57.78,26.04 v57.78,25.4
  Top 2.286: 31.75,26.04 33.66,26.04 | 53.34,26.04 53.34,24.77 | 53.34,26.04 57.78,26.04 59.05,26.04 | 53.34,26.04 D1.C | 53.34,18.41 F1.P$1
  Top 4.826: 53.34,24.77 53.34,18.41
  Bottom 0.254: v75.56,25.4 77.22,25.4 77.6,25.02 77.6,11.94 76.2,10.54 R26.2
  Bottom 1.016: 53.34,26.04 v53.98,25.4 | 74.93,26.04 v74.3,25.4 v75.56,25.4 | 44.45,26.04 C20.1 | 36.83,26.04 C21.1 | 62.23,26.04 C19.1 | 69.85,26.04 C18.1 | 53.34,26.04 v52.7,26.67 | 53.34,26.04 v53.98,26.67 | 53.34,26.04 v52.7,25.4 | 31.75,26.04 v31.11,26.67 | 31.75,26.04 v31.11,25.4 | 31.75,26.04 v32.38,26.67 | v32.38,25.4 31.75,26.04 | v57.78,26.67 57.78,26.04 v57.78,25.4 | 48.9,26.04 v48.9,25.4
  Bottom 2.286: 31.75,26.04 36.83,26.04 44.45,26.04 48.9,26.04 53.34,26.04 57.78,26.04 62.23,26.04 69.85,26.04 74.93,26.04
XTAL1
  Top 0.254: IC5.8 14.4,11.73 14.35,11.68 12.19,11.68 11.18,10.67 Q1.1 10.41,10.67 8.98,12.1 C9.2

### Text on the board
Top: Ni | APB | 10
Bottom: APB
tSilk: 5V | COD2 | COD1 | Ni! | DEV | mimot | APBTeam 2010 | 9V to 28V | M2 | M1 | 5A | BAT | I2C | PC | +